# Altium project Cup_Dispenser_Prototype.PrjPcb
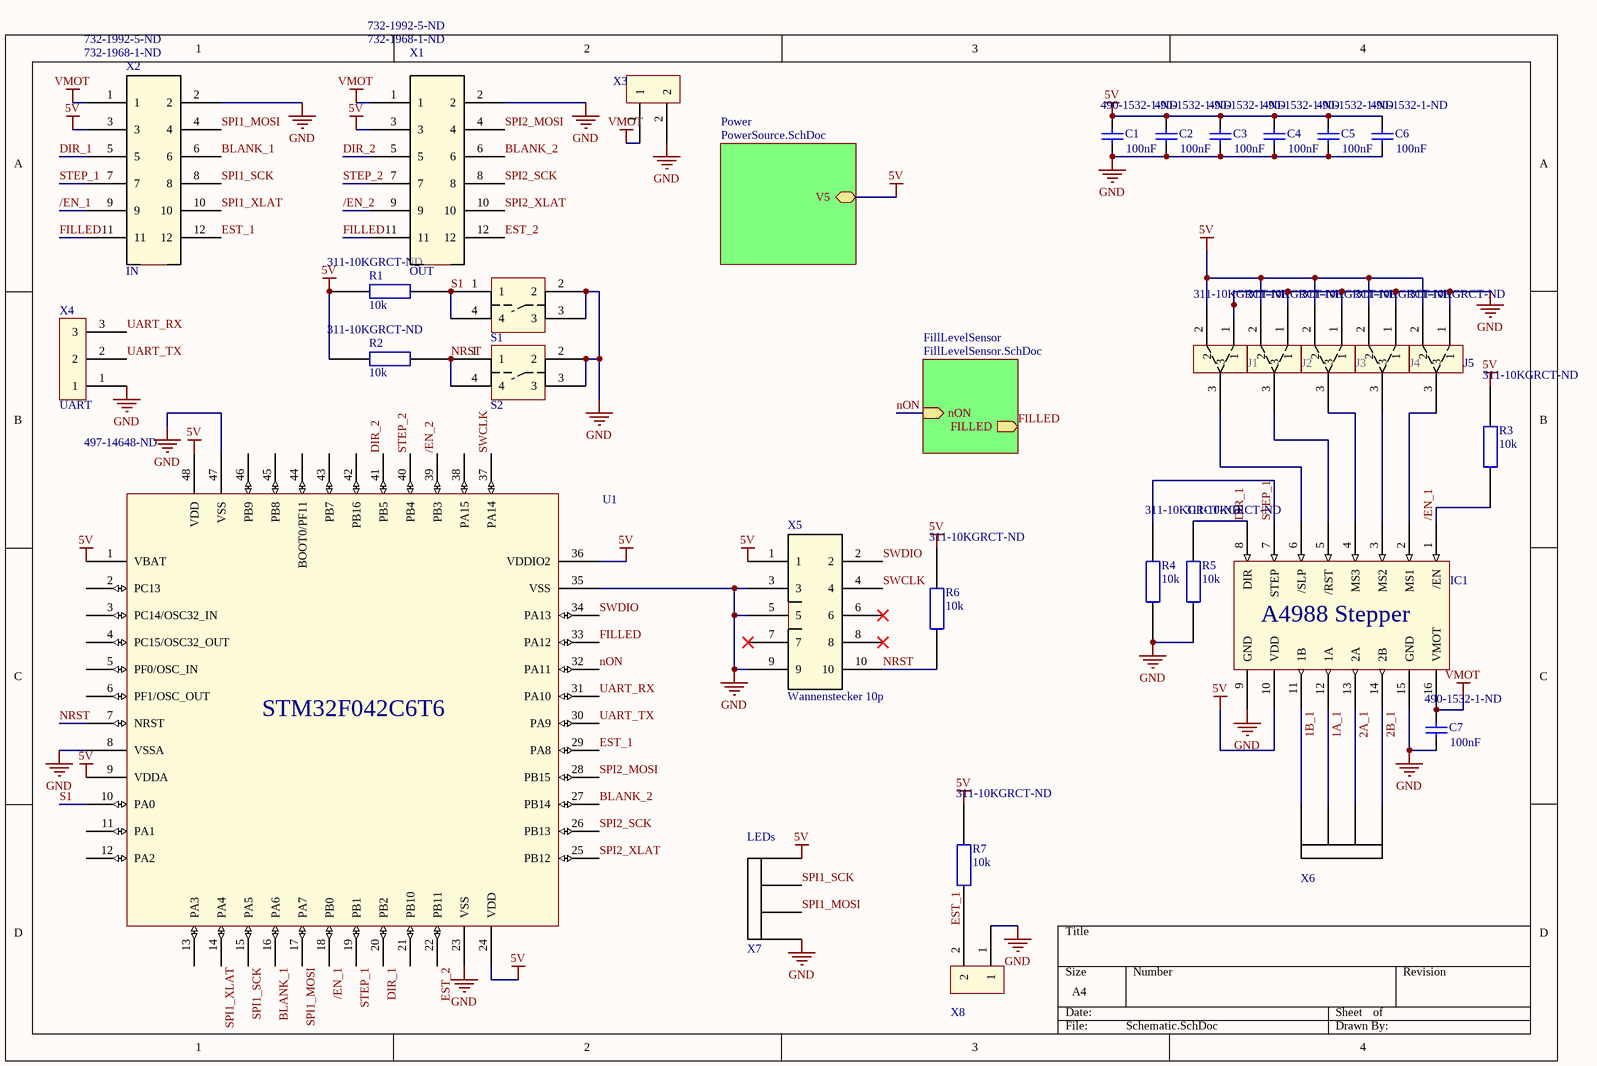
[diagram p0: Schematic.SchDoc]
4 sheets, 50 parts. Net scope: hierarchical (ports join the sheet entries above them; power ports are global).
Board file: Board.PcbDoc
Sheets:
  Schematic.SchDoc
    FillLevelSensor = FillLevelSensor.SchDoc
  LedLogic.SchDoc
    LED1 = LED.SchDoc
    LED2 = LED.SchDoc
    LED3 = LED.SchDoc
    LED4 = LED.SchDoc
    LED5 = LED.SchDoc
    LED6 = LED.SchDoc
    LED7 = LED.SchDoc
    LED8 = LED.SchDoc

## Sheet Schematic.SchDoc
size A4

### Parts
C1  value 100nF  Supplier Part Number 1: 490-1532-1-ND  [Res 0603]  (hidden comment: Cap)
C2  value 100nF  Supplier Part Number 1: 490-1532-1-ND  [Res 0603]  (hidden comment: Cap)
C3  value 100nF  Supplier Part Number 1: 490-1532-1-ND  [Res 0603]  (hidden comment: Cap)
C4  value 100nF  Supplier Part Number 1: 490-1532-1-ND  [Res 0603]  (hidden comment: Cap)
C5  value 100nF  Supplier Part Number 1: 490-1532-1-ND  [Res 0603]  (hidden comment: Cap)
C6  value 100nF  Supplier Part Number 1: 490-1532-1-ND  [Res 0603]  (hidden comment: Cap)
C7  value 100nF  Supplier Part Number 1: 490-1532-1-ND  [Res 0603]  (hidden comment: Cap)
IC1  A4988 Stepper  [A4988 Stepper]  (value not drawn)
J1  Supplier Part Number 1: 311-10KGRCT-ND  [VCC to GND Jumper]  (hidden comment: VCC to GND Jumper)
J2  Supplier Part Number 1: 311-10KGRCT-ND  [VCC to GND Jumper]  (hidden comment: VCC to GND Jumper)
J3  Supplier Part Number 1: 311-10KGRCT-ND  [VCC to GND Jumper]  (hidden comment: VCC to GND Jumper)
J4  Supplier Part Number 1: 311-10KGRCT-ND  [VCC to GND Jumper]  (hidden comment: VCC to GND Jumper)
J5  Supplier Part Number 1: 311-10KGRCT-ND  [VCC to GND Jumper]  (hidden comment: VCC to GND Jumper)
R1  10k  Supplier Part Number 1: 311-10KGRCT-ND  [Res 0603]
R2  10k  Supplier Part Number 1: 311-10KGRCT-ND  [Res 0603]
R3  10k  Supplier Part Number 1: 311-10KGRCT-ND  [Res 0603]
R4  10k  Supplier Part Number 1: 311-10KGRCT-ND  [Res 0603]
R5  10k  Supplier Part Number 1: 311-10KGRCT-ND  [Res 0603]
R6  10k  Supplier Part Number 1: 311-10KGRCT-ND  [Res 0603]
R7  10k  Supplier Part Number 1: 311-10KGRCT-ND  [Res 0603]
S1  Taster  [Taster]  (value not drawn)
S2  Taster  [Taster]  (value not drawn)
U1  Supplier Part Number 1: 497-14648-ND  [LQFP48]  (hidden comment: STM32F042C6T6)
X1  OUT  Supplier Part Number 1: 732-1968-1-ND  Supplier Part Number 2: 732-1992-5-ND  [12p Wurth 690 367 28 12 76]
X2  IN  Supplier Part Number 1: 732-1968-1-ND  Supplier Part Number 2: 732-1992-5-ND  [12p Wurth 690 367 28 12 76]
X3  2p Connector  [2p 2.54 pitch]  (value not drawn)
X4  UART  [3p 2.54 pitch]
X5  Wannenstecker 10p  [Wannenstecker 10p]
X6  4p Connector  [4p 2.54 pitch Motor Connector]  (value not drawn)
X7  LEDs  [4p 2.54 pitch]
X8  2p Connector  [2p 2.54 pitch]  (value not drawn)

### Sub-sheets
FillLevelSensor = FillLevelSensor.SchDoc: nON (in), FILLED (out)
Power = PowerSource.SchDoc (file not in this document): V5

### Nets
5V: C1.2 C2.2 C3.2 C4.2 C5.2 C6.2 IC1.10(VDD) J1.2 J2.2 J3.2 J4.2 J5.2 R1.2 R2.2 R3.2 R6.2 R7.2 U1.1(VBAT) U1.9(VDDA) U1.24(VDD) U1.36(VDDIO2) U1.48(VDD) X1.3 X2.3 X5.1 X7.4 ; sheet Power/V5
GND: C1.1 C2.1 C3.1 C4.1 C5.1 C6.1 C7.1 IC1.9(GND) IC1.15(GND) J1.1 J2.1 J3.1 J4.1 J5.1 R4.1 R5.1 S1.2 S1.3 S2.2 S2.3 U1.8(VSSA) U1.23(VSS) U1.35(VSS) U1.47(VSS) X1.2 X2.2 X3.2 X4.1 X5.3 X5.5 X5.9 X7.1 X8.1
VMOT: C7.2 IC1.16(VMOT) X1.1 X2.1 X3.1
1A_1: IC1.12(1A) X6.3
1B_1: IC1.11(1B) X6.4
2A_1: IC1.13(2A) X6.2
2B_1: IC1.14(2B) X6.1
/EN_1: IC1.1(/EN) R3.1 U1.18(PB0) X2.9
/EN_2: U1.39(PB3) X1.9
BLANK_1: U1.16(PA6) X2.6
BLANK_2: U1.27(PB14) X1.6
DIR_1: IC1.8(DIR) R5.2 U1.20(PB2) X2.5
DIR_2: U1.41(PB5) X1.5
EST_1: R7.1 U1.29(PA8) X2.12 X8.2
EST_2: U1.22(PB11) X1.12
FILLED: U1.33(PA12) X1.11 X2.11 ; sheet FillLevelSensor/FILLED
nON: U1.32(PA11) ; sheet FillLevelSensor/nON
NRST: R2.1 R6.1 S2.1 S2.4 U1.7(NRST) X5.10
S1: R1.1 S1.1 S1.4 U1.10(PA0)
SPI1_MOSI: U1.17(PA7) X2.4 X7.2
SPI1_SCK: U1.15(PA5) X2.8 X7.3
SPI1_XLAT: U1.14(PA4) X2.10
SPI2_MOSI: U1.28(PB15) X1.4
SPI2_SCK: U1.26(PB13) X1.8
SPI2_XLAT: U1.25(PB12) X1.10
STEP_1: IC1.7(STEP) R4.2 U1.19(PB1) X2.7
STEP_2: U1.40(PB4) X1.7
SWCLK: U1.37(PA14) X5.4
SWDIO: U1.34(PA13) X5.2
UART_RX: U1.31(PA10) X4.3
UART_TX: U1.30(PA9) X4.2
NetIC1_2: IC1.2(MS1) J5.3
NetIC1_3: IC1.3(MS2) J4.3
NetIC1_4: IC1.4(MS3) J3.3
NetIC1_5: IC1.5(/RST) J2.3
NetIC1_6: IC1.6(/SLP) J1.3

Not connected (* = marked no-connect by the designer): U1 2(PC13) 3(PC14/OSC32_IN) 4(PC15/OSC32_OUT) 5(PF0/OSC_IN) 6(PF1/OSC_OUT) 11(PA1) 12(PA2) 13(PA3) 21(PB10) 38(PA15) 42(PB16) 43(PB7) 44(BOOT0/PF11) 45(PB8) 46(PB9); X5 6* 7* 8*

### Library data of the parts
C1-C7 = Cap: Capacitor; Published: 8-Jun-2000; LatestRevisionDate: 17-Jul-2002; LatestRevisionNote: Re-released for DXP Platform.; PackageReference: RAD-0.3; Publisher: Altium Limited; PackageDescription: Radial Cap, Thru-Hole; 2 Leads; 0.3 in Pin Spacing; Supplier 1: Digi-Key
R1-R7 = Res: Value: 10k; Supplier 1: Digi-Key
X1 X2 = 12p Connector: Supplier 1: Digi-Key; Supplier 2: Digi-Key
X4 = 3p Connector
X7 = 4p Connector
J1-J5 = VCC to GND Jumper: Supplier 1: Digi-Key
U1 = STM32F042C6T6: Supplier 1: Digi-Key

## Sheet FillLevelSensor.SchDoc
size A4
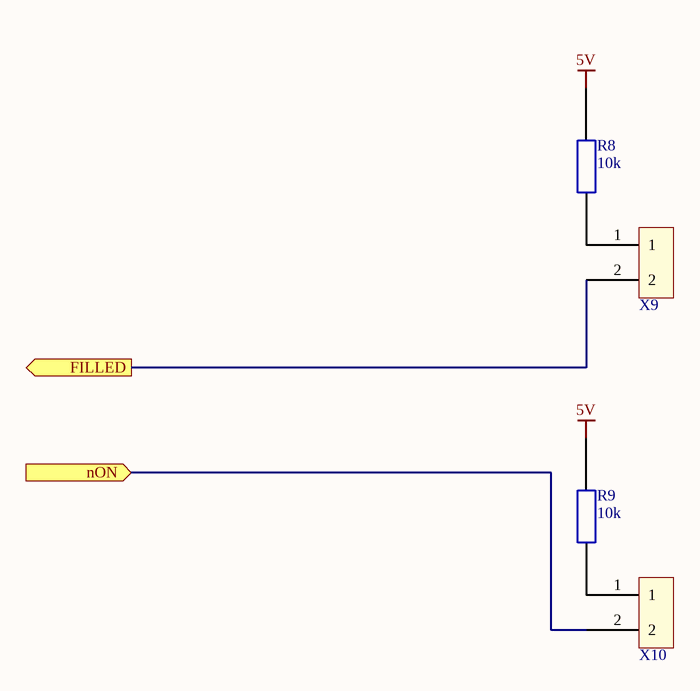
[diagram p1: FillLevelSensor.SchDoc]

### Parts
(Parts that share a designator on the sheet are numbered #1, #2 ... from top to bottom, then left to right.)
R8#1  10k  [Res 0603]
R9#1  10k  [Res 0603]
X9  2p Connector  [2p 2.54 pitch, diode]  (value not drawn)
X10  2p Connector  [2p 2.54 pitch, diode]  (value not drawn)

### Ports
FILLED (out), nON (in)

### Nets
5V: R8#1.2 R9#1.2
FILLED: X9.2 ; port FILLED
nON: X10.2 ; port nON
NetR8#1_1: R8#1.1 X9.1
NetR9#1_1: R9#1.1 X10.1

### Library data of the parts
R8#1 R9#1 = Res: Value: 10k

## Sheet LedLogic.SchDoc
size A4
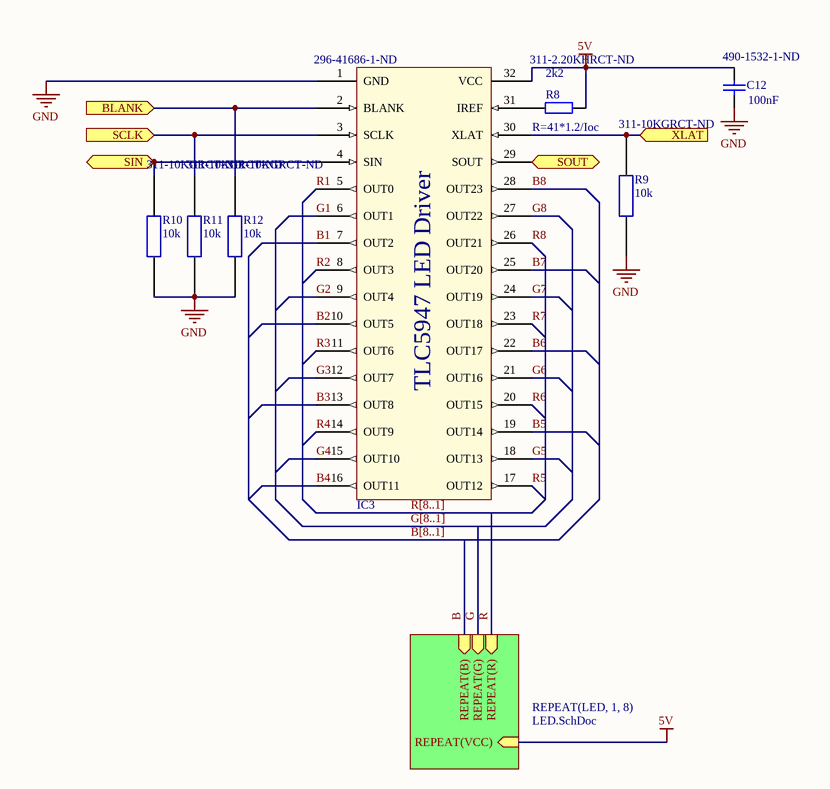
[diagram p2: LedLogic.SchDoc]

### Parts
(Parts that share a designator on the sheet are numbered #1, #2 ... from top to bottom, then left to right.)
C12  value 100nF  Supplier Part Number 1: 490-1532-1-ND  [Res 0603]  (hidden comment: Cap)
IC3  Supplier Part Number 1: 296-41686-1-ND  [TSOP 32Pin]  (hidden comment: TLC5947 LED Driver)
R8#2  value 2k2  Supplier Part Number 1: 311-2.20KHRCT-ND  [Res 0603]  (hidden comment: Res2)
R9#2  10k  Supplier Part Number 1: 311-10KGRCT-ND  [Res 0603]
R10  10k  Supplier Part Number 1: 311-10KGRCT-ND  [Res 0603]
R11  10k  Supplier Part Number 1: 311-10KGRCT-ND  [Res 0603]
R12  10k  Supplier Part Number 1: 311-10KGRCT-ND  [Res 0603]

### Sub-sheets
REPEAT(LED, 1, 8) = LED.SchDoc: REPEAT(R) (in), REPEAT(G) (in), REPEAT(B) (in), REPEAT(VCC) (in)

### Ports
BLANK (in), SCLK (in), SIN (in), SOUT (out), XLAT (in)

### Nets
5V: C12.2 IC3.32(VCC) R8#2.2 ; sheet REPEAT(LED, 1, 8)/REPEAT(VCC)
GND: C12.1 IC3.1(GND) R9#2.2 R10.2 R11.2 R12.2
B: sheet REPEAT(LED, 1, 8)/REPEAT(B)
B1: IC3.7(OUT2)
B2: IC3.10(OUT5)
B3: IC3.13(OUT8)
B4: IC3.16(OUT11)
B5: IC3.19(OUT14)
B6: IC3.22(OUT17)
B7: IC3.25(OUT20)
B8: IC3.28(OUT23)
G: sheet REPEAT(LED, 1, 8)/REPEAT(G)
G1: IC3.6(OUT1)
G2: IC3.9(OUT4)
G3: IC3.12(OUT7)
G4: IC3.15(OUT10)
G5: IC3.18(OUT13)
G6: IC3.21(OUT16)
G7: IC3.24(OUT19)
G8: IC3.27(OUT22)
R: sheet REPEAT(LED, 1, 8)/REPEAT(R)
R1: IC3.5(OUT0)
R2: IC3.8(OUT3)
R3: IC3.11(OUT6)
R4: IC3.14(OUT9)
R5: IC3.17(OUT12)
R6: IC3.20(OUT15)
R7: IC3.23(OUT18)
R8: IC3.26(OUT21)
NetIC3_2: IC3.2(BLANK) R12.1 ; port BLANK
NetIC3_3: IC3.3(SCLK) R11.1 ; port SCLK
NetIC3_4: IC3.4(SIN) R10.1 ; port SIN
NetIC3_29: IC3.29(SOUT) ; port SOUT
NetIC3_30: IC3.30(XLAT) R9#2.1 ; port XLAT
NetIC3_31: IC3.31(IREF) R8#2.1

### Buses and harness runs
bus B[8..1]
bus G[8..1]
bus R[8..1]

### Notes on the sheet
- (near R8#2) R=41*1.2/Ioc

### Library data of the parts
C12 = Cap: Capacitor; Published: 8-Jun-2000; LatestRevisionDate: 17-Jul-2002; LatestRevisionNote: Re-released for DXP Platform.; PackageReference: RAD-0.3; Publisher: Altium Limited; PackageDescription: Radial Cap, Thru-Hole; 2 Leads; 0.3 in Pin Spacing; Supplier 1: Digi-Key
R8#2 = Res2: Resistor; Published: 8-Jun-2000; LatestRevisionDate: 17-Jul-2002; LatestRevisionNote: Re-released for DXP Platform.; PackageReference: AXIAL-0.4; Publisher: Altium Limited; PackageDescription: Axial Device, Thru-Hole; 2 Leads; 0.4 in Pin Spacing; Supplier 1: Digi-Key
R9#2 R10-R12 = Res: Value: 10k; Supplier 1: Digi-Key
IC3 = TLC5947 LED Driver: Supplier 1: Digi-Key

## Sheet LED.SchDoc
size A4
Used 8 times, as channels LED1, LED2, LED3, LED4, LED5, LED6, LED7, LED8. Parts and nets are listed once, with the designators drawn on the sheet.
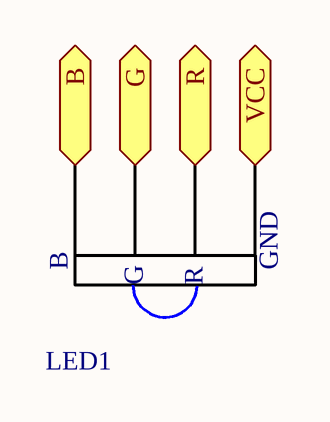
[diagram p3: LED.SchDoc]

### Parts
LED1  LED 4p  [4p 2.54 pitch LED]  (value not drawn)

### Ports
B (out), G (out), R (out), VCC (in)

### Nets
B: LED1.4 ; port B
G: LED1.3 ; port G
R: LED1.2 ; port R
VCC: LED1.1 ; port VCC

### Channels
LED1: designators end in _LED1; ports B=B1 G=G1 R=R1 VCC=NetLED1_LED1_1
LED2: designators end in _LED2; ports B=B2 G=G2 R=R2 VCC=NetLED1_LED2_1
LED3: designators end in _LED3; ports B=B3 G=G3 R=R3 VCC=NetLED1_LED3_1
LED4: designators end in _LED4; ports B=B4 G=G4 R=R4 VCC=NetLED1_LED4_1
LED5: designators end in _LED5; ports B=B5 G=G5 R=R5 VCC=NetLED1_LED5_1
LED6: designators end in _LED6; ports B=B6 G=G6 R=R6 VCC=NetLED1_LED6_1
LED7: designators end in _LED7; ports B=B7 G=G7 R=R7 VCC=NetLED1_LED7_1
LED8: designators end in _LED8; ports B=B8 G=G8 R=R8 VCC=NetLED1_LED8_1

### Notes on the sheet
- (in symbol LED 4p) B; GND; G; R

## Nets that join several sheets
5V: Schematic (26 pins), FillLevelSensor (R8#1.2 R9#1.2), LedLogic (C12.2 IC3.32 R8#2.2)
GND: Schematic (33 pins), LedLogic (6 pins)
B1: LedLogic (IC3.7), LED1 (LED1_LED1.4)
B2: LedLogic (IC3.10), LED2 (LED1_LED2.4)
B3: LedLogic (IC3.13), LED3 (LED1_LED3.4)
B4: LedLogic (IC3.16), LED4 (LED1_LED4.4)
B5: LedLogic (IC3.19), LED5 (LED1_LED5.4)
B6: LedLogic (IC3.22), LED6 (LED1_LED6.4)
B7: LedLogic (IC3.25), LED7 (LED1_LED7.4)
B8: LedLogic (IC3.28), LED8 (LED1_LED8.4)
FILLED: Schematic (U1.33 X1.11 X2.11), FillLevelSensor (X9.2)
G1: LedLogic (IC3.6), LED1 (LED1_LED1.3)
G2: LedLogic (IC3.9), LED2 (LED1_LED2.3)
G3: LedLogic (IC3.12), LED3 (LED1_LED3.3)
G4: LedLogic (IC3.15), LED4 (LED1_LED4.3)
G5: LedLogic (IC3.18), LED5 (LED1_LED5.3)
G6: LedLogic (IC3.21), LED6 (LED1_LED6.3)
G7: LedLogic (IC3.24), LED7 (LED1_LED7.3)
G8: LedLogic (IC3.27), LED8 (LED1_LED8.3)
nON: Schematic (U1.32), FillLevelSensor (X10.2)
R1: LedLogic (IC3.5), LED1 (LED1_LED1.2)
R2: LedLogic (IC3.8), LED2 (LED1_LED2.2)
R3: LedLogic (IC3.11), LED3 (LED1_LED3.2)
R4: LedLogic (IC3.14), LED4 (LED1_LED4.2)
R5: LedLogic (IC3.17), LED5 (LED1_LED5.2)
R6: LedLogic (IC3.20), LED6 (LED1_LED6.2)
R7: LedLogic (IC3.23), LED7 (LED1_LED7.2)
R8: LedLogic (IC3.26), LED8 (LED1_LED8.2)